# Altium schematic sheet LIDO-HW.100.FrontConnector.SchDoc
size A3; CompanyName: EST-Floattech; DrawnBy: RR; Organization: EST-Floattech; Address2: Zandsteen 1; Address3: 2132 MZ; Address4: Hoofddorp; DocumentNumber: 21xxx; Revision: 1.0; SheetNumber: 4; SheetTotal: 17
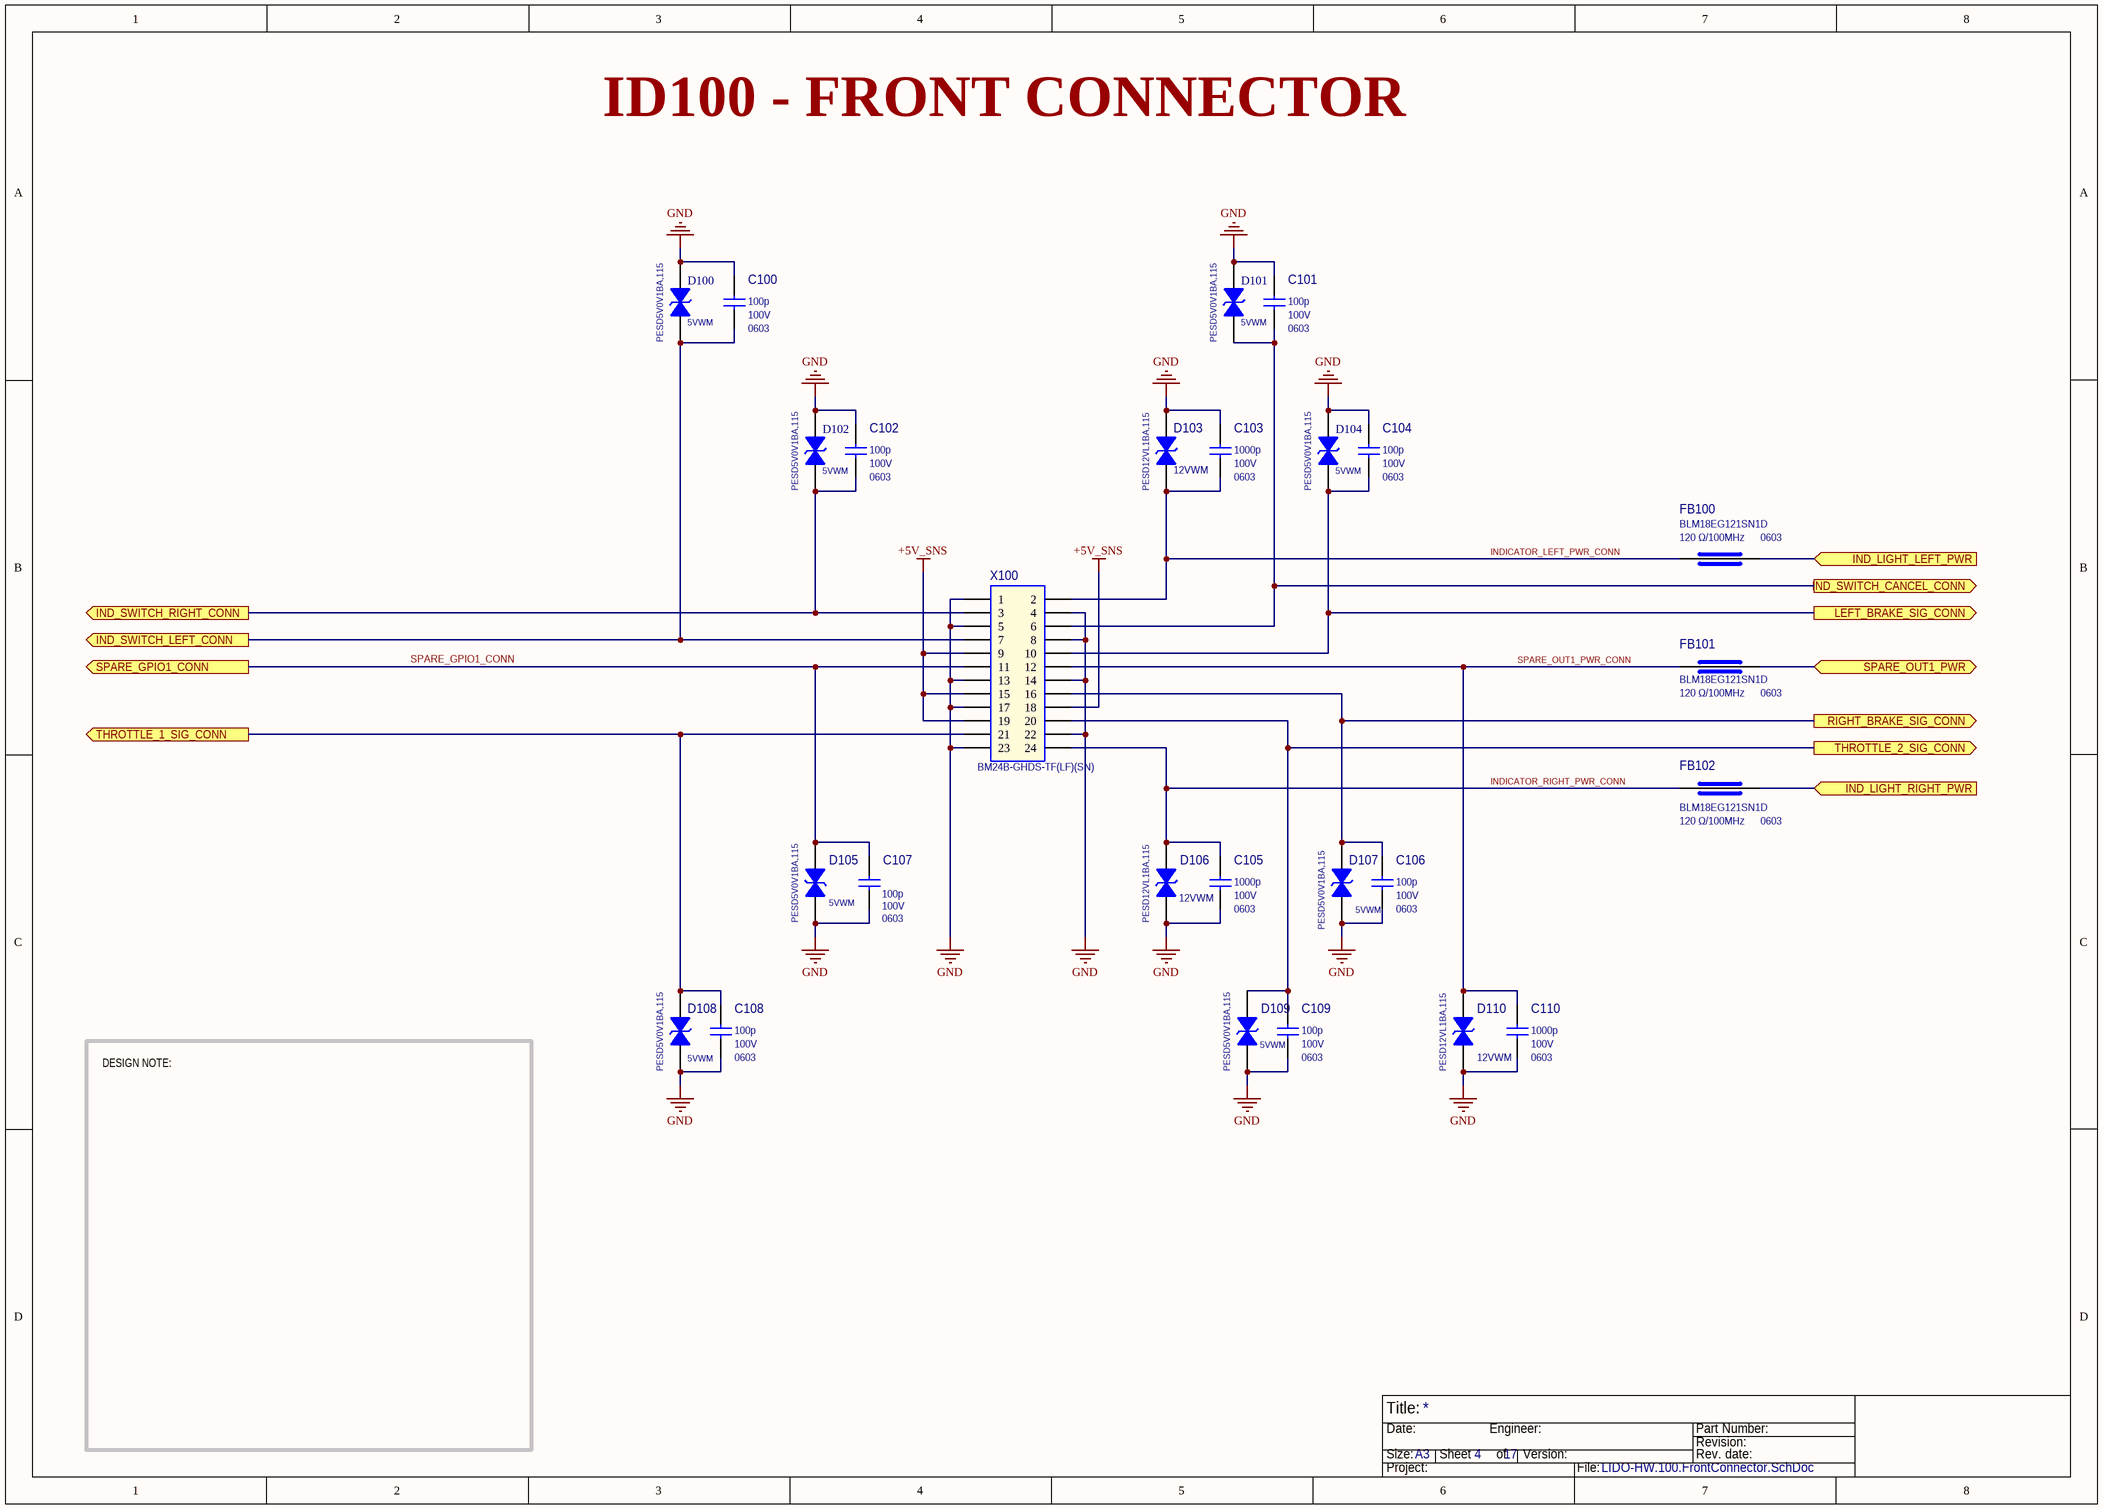
[diagram p0: LIDO-HW.100.FrontConnector.SchDoc]

## Parts
C100  Part Value 2: 100V  Part Package: 0603  [CAP_0603_1608X90-N_MURATA_A]  (hidden comment: 100p)
C101  Part Value 2: 100V  Part Package: 0603  [CAP_0603_1608X90-N_MURATA_A]  (hidden comment: 100p)
C102  Part Value 2: 100V  Part Package: 0603  [CAP_0603_1608X90-N_MURATA_A]  (hidden comment: 100p)
C103  Part Value 2: 100V  Part Package: 0603  [CAP_0603_1608X90-N_MURATA_A]  (hidden comment: 1000p)
C104  Part Value 2: 100V  Part Package: 0603  [CAP_0603_1608X90-N_MURATA_A]  (hidden comment: 100p)
C105  Part Value 2: 100V  Part Package: 0603  [CAP_0603_1608X90-N_MURATA_A]  (hidden comment: 1000p)
C106  Part Value 2: 100V  Part Package: 0603  [CAP_0603_1608X90-N_MURATA_A]  (hidden comment: 100p)
C107  Part Value 2: 100V  Part Package: 0603  [CAP_0603_1608X90-N_MURATA_A]  (hidden comment: 100p)
C108  Part Value 2: 100V  Part Package: 0603  [CAP_0603_1608X90-N_MURATA_A]  (hidden comment: 100p)
C109  Part Value 2: 100V  Part Package: 0603  [CAP_0603_1608X90-N_MURATA_A]  (hidden comment: 100p)
C110  Part Value 2: 100V  Part Package: 0603  [CAP_0603_1608X90-N_MURATA_A]  (hidden comment: 1000p)
D100  Manufacturer Part Number: PESD5V0V1BA,115  [NXP_SOD-323_250X125X95L30x32_A]  (hidden comment: 5VWM)
D101  Manufacturer Part Number: PESD5V0V1BA,115  [NXP_SOD-323_250X125X95L30x32_A]  (hidden comment: 5VWM)
D102  Manufacturer Part Number: PESD5V0V1BA,115  [NXP_SOD-323_250X125X95L30x32_A]  (hidden comment: 5VWM)
D103  Manufacturer Part Number: PESD12VL1BA,115  [NXP_SOD-323_250X125X95L30x32_A]  (hidden comment: 12VWM)
D104  Manufacturer Part Number: PESD5V0V1BA,115  [NXP_SOD-323_250X125X95L30x32_A]  (hidden comment: 5VWM)
D105  Manufacturer Part Number: PESD5V0V1BA,115  [NXP_SOD-323_250X125X95L30x32_A]  (hidden comment: 5VWM)
D106  Manufacturer Part Number: PESD12VL1BA,115  [NXP_SOD-323_250X125X95L30x32_A]  (hidden comment: 12VWM)
D107  Manufacturer Part Number: PESD5V0V1BA,115  [NXP_SOD-323_250X125X95L30x32_A]  (hidden comment: 5VWM)
D108  Manufacturer Part Number: PESD5V0V1BA,115  [NXP_SOD-323_250X125X95L30x32_A]  (hidden comment: 5VWM)
D109  Manufacturer Part Number: PESD5V0V1BA,115  [NXP_SOD-323_250X125X95L30x32_A]  (hidden comment: 5VWM)
D110  Manufacturer Part Number: PESD12VL1BA,115  [NXP_SOD-323_250X125X95L30x32_A]  (hidden comment: 12VWM)
FB100  Manufacturer Part Number: BLM18EG121SN1D  Part Package: 0603  [IND_0603_1608X95-N_AVX_A]  (hidden comment: 120 Ω/100MHz)
FB101  Manufacturer Part Number: BLM18EG121SN1D  Part Package: 0603  [IND_0603_1608X95-N_AVX_A]  (hidden comment: 120 Ω/100MHz)
FB102  Manufacturer Part Number: BLM18EG121SN1D  Part Package: 0603  [IND_0603_1608X95-N_AVX_A]  (hidden comment: 120 Ω/100MHz)
X100  BM24B-GHDS-TF(LF)(SN)  [JST_BM24B-GHDS-TF_A]

## Ports
IND_LIGHT_LEFT_PWR (in), IND_LIGHT_RIGHT_PWR (in), IND_SWITCH_CANCEL_CONN (out), IND_SWITCH_LEFT_CONN (out), IND_SWITCH_RIGHT_CONN (out), LEFT_BRAKE_SIG_CONN (out), RIGHT_BRAKE_SIG_CONN (out), SPARE_GPIO1_CONN (out), SPARE_OUT1_PWR (bidir), THROTTLE_1_SIG_CONN (out), THROTTLE_2_SIG_CONN (out)

## Nets
+5V_SNS: X100.9 X100.15 X100.18 X100.19
GND: C100.1 C101.1 C102.1 C103.1 C104.1 C105.2 C106.2 C107.1 C108.2 C109.2 C110.2 D100.A D101.A D102.A D103.A D104.A D105.A D106.A D107.A D108.A D109.A D110.A X100.1 X100.4 X100.5 X100.8 X100.13 X100.14 X100.17 X100.22 X100.23
IND_LIGHT_LEFT_PWR: FB100.2 ; port IND_LIGHT_LEFT_PWR
IND_LIGHT_RIGHT_PWR: FB102.2 ; port IND_LIGHT_RIGHT_PWR
IND_SWITCH_CANCEL_CONN: C101.2 D101.C X100.6 ; port IND_SWITCH_CANCEL_CONN
IND_SWITCH_LEFT_CONN: C100.2 D100.C X100.7 ; port IND_SWITCH_LEFT_CONN
IND_SWITCH_RIGHT_CONN: C102.2 D102.C X100.3 ; port IND_SWITCH_RIGHT_CONN
INDICATOR_LEFT_PWR_CONN: C103.2 D103.C FB100.1 X100.2
INDICATOR_RIGHT_PWR_CONN: C105.1 D106.C FB102.1 X100.24
LEFT_BRAKE_SIG_CONN: C104.2 D104.C X100.10 ; port LEFT_BRAKE_SIG_CONN
RIGHT_BRAKE_SIG_CONN: C106.1 D107.C X100.16 ; port RIGHT_BRAKE_SIG_CONN
SPARE_GPIO1_CONN: C107.2 D105.C X100.11 ; port SPARE_GPIO1_CONN
SPARE_OUT1_PWR: FB101.1 ; port SPARE_OUT1_PWR
SPARE_OUT1_PWR_CONN: C110.1 D110.C FB101.2 X100.12
THROTTLE_1_SIG_CONN: C108.1 D108.C X100.21 ; port THROTTLE_1_SIG_CONN
THROTTLE_2_SIG_CONN: C109.1 D109.C X100.20 ; port THROTTLE_2_SIG_CONN

## Notes on the sheet
- ID100 - FRONT CONNECTOR
- DESIGN NOTE:
- Title:
- Size:
- Date:
- A3
- Sheet       of
- Engineer:
- Version:
- Part Number:
- Revision:
- Rev. date:
- Project:
- File:

## Library data of the parts
C100-C102 C104 C106-C109 = 75: CAP CER 100PF 100V C0G 0603; Manufacturer Part Number: CGA3E2C0G2A101J080AA; Manufacturer: TDK Corporation; Obsolete Part: False; Component ID: 75; Part Value: 100p; Part Value 3: 5%; Package Type: SMT
C103 C105 C110 = 84: CAP CER 1000PF 100V X7R 0603; Manufacturer Part Number: CGA3E2X7R2A102K080AA; Manufacturer: TDK Corporation; Obsolete Part: False; Component ID: 84; Part Value: 1000p; Part Value 3: X7R; Package Type: SMT
D100-D102 D104 D105 D107-D109 = 32: 12.5V Clamp 4.8A (8/20µs) Ipp Tvs Diode Surface Mount SOD-323; Manufacturer: Nexperia USA Inc.; Part Package: SOD323; Obsolete Part: False; Component ID: 32; Part Type: TVS; Part Value: 5VWM; Package Type: SMT
D103 D106 D110 = 33: 37V Clamp 5A (8/20µs) Ipp Tvs Diode Surface Mount SOD-323; Manufacturer: Nexperia USA Inc.; Part Package: SOD323; Obsolete Part: False; Component ID: 33; Part Type: TVS; Part Value: 12VWM; Package Type: SMT
FB100-FB102 = 16: FERRITE BEAD 120 OHM 0603 1LN; Manufacturer: Murata Electronics; Obsolete Part: False; Component ID: 16; Part Value: 120 Ω/100MHz; Part Value 2: 2.0A; Package Type: SMT
X100 = 56: Connector Header Surface Mount 24 position 0.049" (1.25mm); Manufacturer: JST Sales America Inc.; Part Value: 24-Pins; Obsolete Part: False; Component ID: 56; Manufacturer Part Number: BM24B-GHDS-TF(LF)(SN); Part Pitch: 1.25mm